# Altium schematic sheet CPU.SchDoc
size A
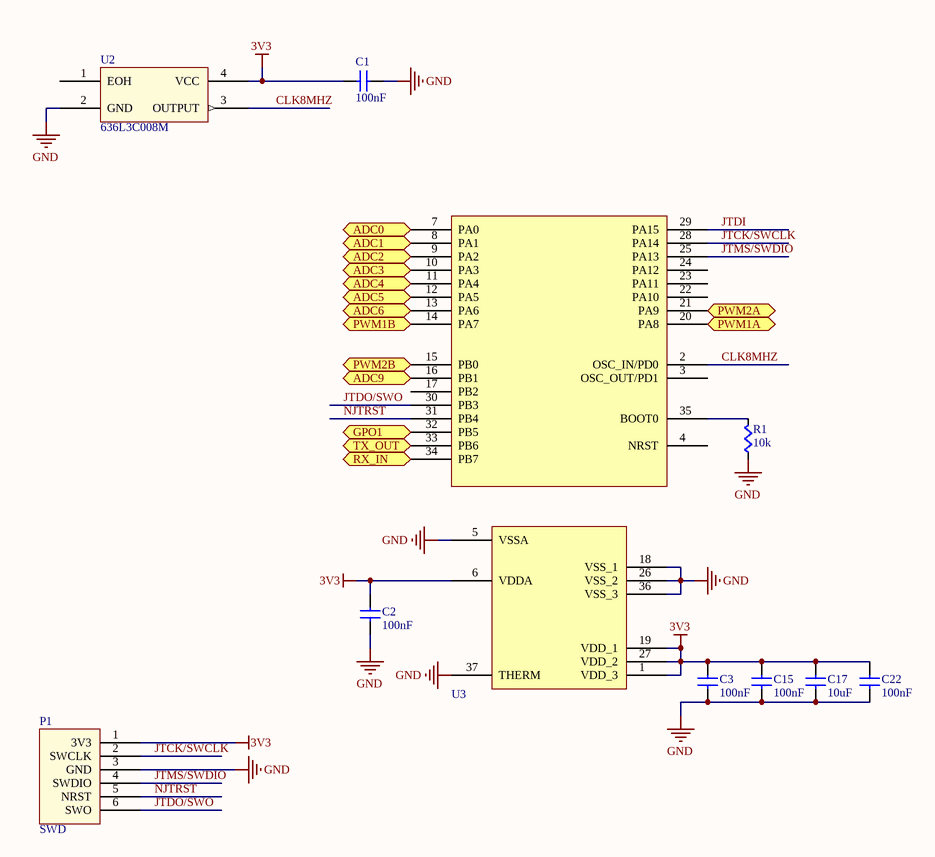
[diagram p0: CPU.SchDoc]

## Parts
C1  value 100nF  [CAPC0603]  (hidden comment: Cap)
C2  value 100nF  [CAPC0603]  (hidden comment: Cap)
C3  value 100nF  [CAPC0603]  (hidden comment: Cap)
C15  value 100nF  [CAPC0603]  (hidden comment: Cap)
C17  value 10uF  [CAPC0603]  (hidden comment: Cap)
C22  value 100nF  [CAPC0603]  (hidden comment: Cap)
P1  SWD  [SWD_STM32_SMD]
R1  value 10k  [RES0603]  (hidden comment: Res)
U2  636L3C008M  [636L3C]
U3  STM32F103TBU6  [STM32F103TBU6_NO_VIAS]  (value not drawn)

## Ports
ADC0 (in), ADC1 (in), ADC2 (in), ADC3 (in), ADC4 (in), ADC5 (in), ADC6 (in), ADC9 (in), GPO1 (out), PWM1A (out), PWM1B (out), PWM2A (out), PWM2B (out), RX_IN (in), TX_OUT (out)

## Nets
3V3: C1.1(A) C2.1(A) C3.1(A) C15.1(A) C17.1(A) C22.1(A) P1.1(3V3) U2.4(VCC) U3.1(VDD_3) U3.6(VDDA) U3.19(VDD_1) U3.27(VDD_2)
GND: C1.2(B) C2.2(B) C3.2(B) C15.2(B) C17.2(B) C22.2(B) P1.3(GND) R1.2(B) U2.2(GND) U3.5(VSSA) U3.18(VSS_1) U3.26(VSS_2) U3.36(VSS_3) U3.37(THERM)
ADC0: U3.7(PA0) ; port ADC0
ADC1: U3.8(PA1) ; port ADC1
ADC2: U3.9(PA2) ; port ADC2
ADC3: U3.10(PA3) ; port ADC3
ADC4: U3.11(PA4) ; port ADC4
ADC5: U3.12(PA5) ; port ADC5
ADC6: U3.13(PA6) ; port ADC6
ADC9: U3.16(PB1) ; port ADC9
CLK8MHZ: U2.3(OUTPUT) U3.2(OSC_IN/PD0)
GPO1: U3.32(PB5) ; port GPO1
JTCK/SWCLK: P1.2(SWCLK) U3.28(PA14)
JTDI: U3.29(PA15)
JTDO/SWO: P1.6(SWO) U3.30(PB3)
JTMS/SWDIO: P1.4(SWDIO) U3.25(PA13)
NJTRST: P1.5(NRST) U3.31(PB4)
PWM1A: U3.20(PA8) ; port PWM1A
PWM1B: U3.14(PA7) ; port PWM1B
PWM2A: U3.21(PA9) ; port PWM2A
PWM2B: U3.15(PB0) ; port PWM2B
RX_IN: U3.34(PB7) ; port RX_IN
TX_OUT: U3.33(PB6) ; port TX_OUT
NetR1_1: R1.1(A) U3.35(BOOT0)

Not connected (* = marked no-connect by the designer): U2 1(EOH); U3 3(OSC_OUT/PD1) 4(NRST) 17(PB2) 22(PA10) 23(PA11) 24(PA12)

## Library data of the parts
P1 = SWD_STM32: SWD connector matching the pinout on STM Discovery Boards
U2 = 636L3C: HCMOS/TTL Clock Oscillator; Supplier 1: Digi-Key; Supplier Part Number 1: CTX1005CT-ND
U3 = STM32F103TBU6: MCU ARM 32BIT 32K FLASH 36VFQFP; Supplier 1: Digi-Key; Supplier Part Number 1: 497-11534-ND
C1-C3 C15 C17 C22 = Cap: Supplier 1: Digi-Key
  C1-C3 C15 C22: Supplier Part Number 1: 399-1095-1-ND
  C17: Supplier Part Number 1: 1276-1871-1-ND
R1 = Res: Supplier 1: Digi-Key; Supplier Part Number 1: RMCF0603JT10K0CT-ND